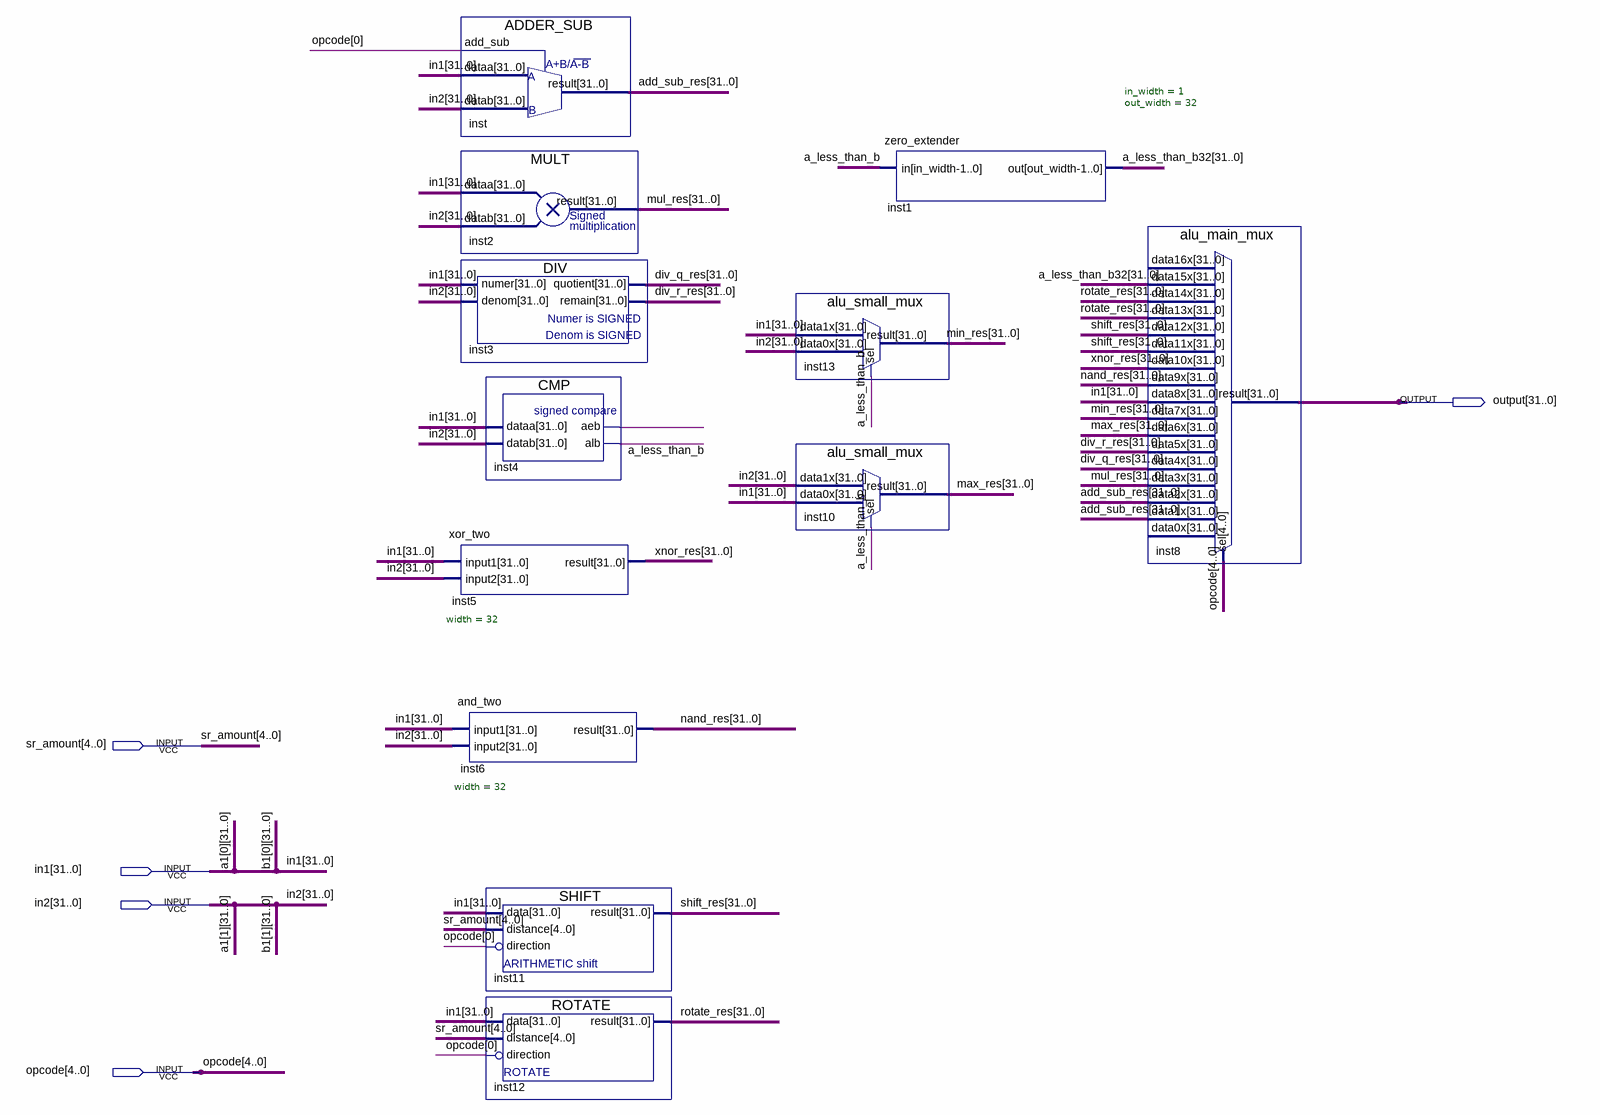
[diagram p0: schematic sheet]
// Quartus schematic ALU.bdf as structural Verilog: 12 symbols, 5 pins
module ALU (
  input  [4:0] sr_amount,
  input  [31:0] in1,
  input  [31:0] in2,
  input  [4:0] opcode,
  output [31:0] \output 
);

  wire a_less_than_b, inst4_aeb;
  wire [31:0] a_less_than_b32, add_sub_res, div_q_res, div_r_res, max_res, min_res, mul_res, nand_res,
       rotate_res, shift_res, xnor_res;

  ADDER_SUB inst (.add_sub(opcode[0]), .dataa(in1), .datab(in2), .result(add_sub_res));
  MULT inst2 (.dataa(in1), .datab(in2), .result(mul_res));
  DIV inst3 (.numer(in1), .denom(in2), .quotient(div_q_res), .remain(div_r_res));
  xor_two #(.width(32)) inst5 (.input1(in1), .input2(in2), .result(xnor_res));
  and_two #(.width(32)) inst6 (.input1(in1), .input2(in2), .result(nand_res));
  CMP inst4 (.dataa(in1), .datab(in2), .aeb(inst4_aeb), .alb(a_less_than_b));
  SHIFT inst11 (.data(in1), .distance(sr_amount), .direction(~opcode[0]), .result(shift_res));
  ROTATE inst12 (.data(in1), .distance(sr_amount), .direction(~opcode[0]), .result(rotate_res));
  alu_small_mux inst13 (.data1x(in1), .data0x(in2), .sel(a_less_than_b), .result(min_res));
  alu_small_mux inst10 (.data1x(in2), .data0x(in1), .sel(a_less_than_b), .result(max_res));
  zero_extender #(.in_width(1), .out_width(32)) inst1 (.in(a_less_than_b), .out(a_less_than_b32));
  alu_main_mux inst8 (
    .data15x(a_less_than_b32), .data14x(rotate_res), .data13x(rotate_res), .data12x(shift_res),
    .data11x(shift_res), .data10x(xnor_res), .data9x(nand_res), .data8x(in1), .data7x(min_res),
    .data6x(max_res), .data5x(div_r_res), .data4x(div_q_res), .data3x(mul_res), .data2x(add_sub_res),
    .data1x(add_sub_res), .sel(opcode), .result(\output ));  // open: data16x, data0x
endmodule
